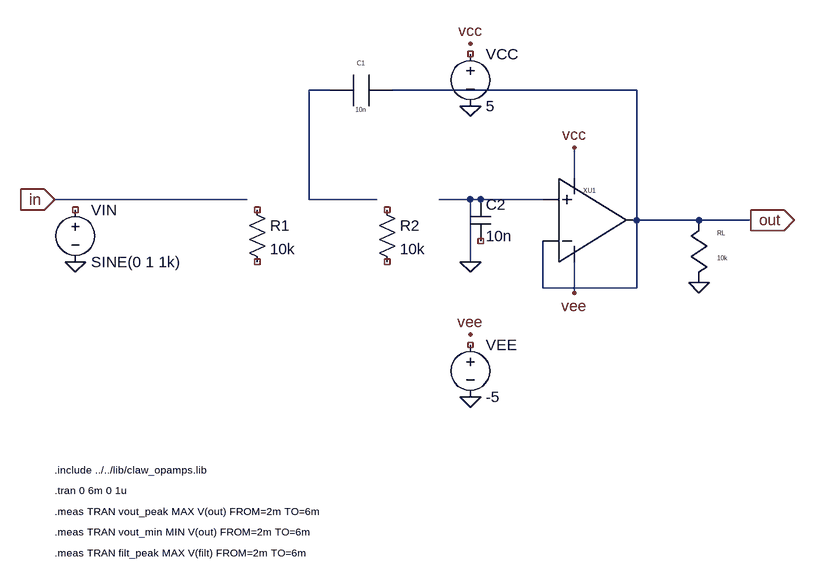
[diagram p0: schematic sallen_key_lowpass.asc]
sallen_key_lowpass.asc, the LTspice schematic file:
Version 4
SHEET 1 1357 1031
WIRE 64 304 360 304
WIRE 456 304 560 304
WIRE 656 304 816 304
WIRE 704 304 704 400
WIRE 456 304 456 136
WIRE 456 136 488 136
WIRE 584 136 960 136
WIRE 960 136 960 336
WIRE 960 336 1136 336
WIRE 960 336 960 440
WIRE 960 440 816 440
WIRE 816 440 816 368
WIRE 864 272 864 224
WIRE 864 400 864 448
SYMBOL voltage 96 304 R0
SYMATTR InstName VIN
SYMATTR Value SINE(0 1 1k)
SYMBOL voltage 704 64 R0
SYMATTR InstName VCC
SYMATTR Value 5
SYMBOL voltage 704 512 R0
SYMATTR InstName VEE
SYMATTR Value -5
SYMBOL res 360 304 R0
SYMATTR InstName R1
SYMATTR Value 10k
SYMBOL res 560 304 R0
SYMATTR InstName R2
SYMATTR Value 10k
SYMBOL cap_h 488 136 R0
SYMATTR InstName C1
SYMATTR Value 10n
SYMBOL cap 704 304 R0
SYMATTR InstName C2
SYMATTR Value 10n
SYMBOL opamp2 816 272 R0
SYMATTR InstName XU1
SYMATTR Value CLAW_IDEAL_OPAMP
SYMBOL res_v 1056 336 R0
SYMATTR InstName RL
SYMATTR Value 10k
FLAG 64 304 in
IOPIN 64 304 In
FLAG 1136 336 out
IOPIN 1136 336 Out
FLAG 96 400 0
FLAG 704 400 0
FLAG 1056 432 0
FLAG 704 64 vcc
FLAG 704 160 0
FLAG 704 512 vee
FLAG 704 608 0
FLAG 864 224 vcc
FLAG 864 448 vee
TEXT 64 720 Left 1 !.include ../../lib/claw_opamps.lib
TEXT 64 752 Left 1 !.tran 0 6m 0 1u
TEXT 64 784 Left 1 !.meas TRAN vout_peak MAX V(out) FROM=2m TO=6m
TEXT 64 816 Left 1 !.meas TRAN vout_min MIN V(out) FROM=2m TO=6m
TEXT 64 848 Left 1 !.meas TRAN filt_peak MAX V(filt) FROM=2m TO=6m

The netlist it stands for:
* sallen_key_lowpass.asc
VIN NC_01 0 SINE(0 1 1k)
VCC NC_02 0 5
VEE NC_03 0 -5
R1 NC_04 NC_05 10k
R2 NC_06 NC_07 10k
C1 N001 out 10n
C2 0 NC_08 10n
XXU1 CLAW_IDEAL_OPAMP CLAW_IDEAL_OPAMP
RL out 0 10k
.include ../../lib/claw_opamps.lib
.tran 0 6m 0 1u
.meas TRAN vout_peak MAX V(out) FROM=2m TO=6m
.meas TRAN vout_min MIN V(out) FROM=2m TO=6m
.meas TRAN filt_peak MAX V(filt) FROM=2m TO=6m
.backanno
.end